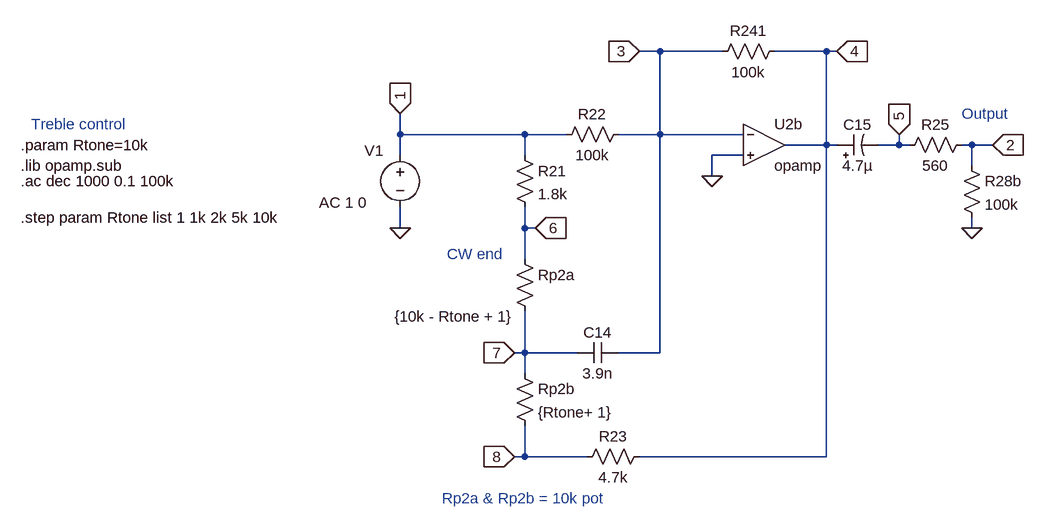
[diagram p0: schematic Klon-Centaur_treble_v1.asc]
Klon-Centaur_treble_v1.asc, the LTspice schematic file:
Version 4
SHEET 1 4496 5064
WIRE 2144 2432 2112 2432
WIRE 2240 2432 2144 2432
WIRE 2400 2432 2320 2432
WIRE 2416 2432 2400 2432
WIRE 1744 2560 1744 2528
WIRE 1936 2560 1744 2560
WIRE 2000 2560 1936 2560
WIRE 2144 2560 2144 2432
WIRE 2144 2560 2080 2560
WIRE 2272 2560 2144 2560
WIRE 2400 2576 2400 2432
WIRE 2400 2576 2336 2576
WIRE 2416 2576 2400 2576
WIRE 2512 2576 2512 2560
WIRE 2512 2576 2480 2576
WIRE 2528 2576 2512 2576
WIRE 2624 2576 2608 2576
WIRE 2656 2576 2624 2576
WIRE 1744 2592 1744 2560
WIRE 1936 2592 1936 2560
WIRE 2272 2592 2224 2592
WIRE 2624 2608 2624 2576
WIRE 2224 2624 2224 2592
WIRE 1744 2704 1744 2672
WIRE 1936 2704 1936 2672
WIRE 1952 2704 1936 2704
WIRE 2624 2704 2624 2688
WIRE 1936 2752 1936 2704
WIRE 1936 2896 1936 2832
WIRE 1936 2896 1920 2896
WIRE 2016 2896 1936 2896
WIRE 2144 2896 2144 2560
WIRE 2144 2896 2080 2896
WIRE 1936 2928 1936 2896
WIRE 1936 3056 1936 3008
WIRE 1936 3056 1920 3056
WIRE 2032 3056 1936 3056
WIRE 2400 3056 2400 2576
WIRE 2400 3056 2112 3056
FLAG 1744 2528 1
IOPIN 1744 2528 In
FLAG 2656 2576 2
IOPIN 2656 2576 In
FLAG 2224 2624 0
FLAG 1744 2704 0
FLAG 2624 2704 0
FLAG 1952 2704 6
IOPIN 1952 2704 In
FLAG 1920 2896 7
IOPIN 1920 2896 In
FLAG 1920 3056 8
IOPIN 1920 3056 In
FLAG 2112 2432 3
IOPIN 2112 2432 In
FLAG 2416 2432 4
IOPIN 2416 2432 In
FLAG 2512 2560 5
IOPIN 2512 2560 In
SYMBOL voltage 1744 2576 R0
WINDOW 0 -55 9 Left 2
WINDOW 123 -125 89 Left 2
WINDOW 39 0 0 Left 0
WINDOW 3 -289 58 Left 2
SYMATTR InstName V1
SYMATTR Value2 AC 1 0
SYMATTR Value ""
SYMBOL res 1920 2576 R0
SYMATTR InstName R21
SYMATTR Value 1.8k
SYMBOL res 2096 2544 R90
WINDOW 0 0 56 VBottom 2
WINDOW 3 32 56 VTop 2
SYMATTR InstName R22
SYMATTR Value 100k
SYMBOL res 1920 2736 R0
WINDOW 3 -2 104 Right 2
SYMATTR Value {10k - Rtone + 1}
SYMATTR InstName Rp2a
SYMBOL res 1920 2912 R0
SYMATTR InstName Rp2b
SYMATTR Value {Rtone+ 1}
SYMBOL cap 2080 2880 R90
WINDOW 0 0 32 VBottom 2
WINDOW 3 32 32 VTop 2
SYMATTR InstName C14
SYMATTR Value 3.9n
SYMBOL res 2336 2416 R90
WINDOW 0 0 56 VBottom 2
WINDOW 3 32 56 VTop 2
SYMATTR InstName R241
SYMATTR Value 100k
SYMBOL res 2624 2560 R90
WINDOW 0 0 56 VBottom 2
WINDOW 3 32 56 VTop 2
SYMATTR InstName R25
SYMATTR Value 560
SYMBOL res 2128 3040 R90
WINDOW 0 0 56 VBottom 2
WINDOW 3 32 56 VTop 2
SYMATTR InstName R23
SYMATTR Value 4.7k
SYMBOL OpAmps\\opamp 2304 2512 R0
SYMATTR InstName U2b
SYMBOL res 2608 2592 R0
SYMATTR InstName R28b
SYMATTR Value 100k
SYMBOL polcap 2416 2592 R270
WINDOW 0 32 32 VTop 2
WINDOW 3 0 32 VBottom 2
SYMATTR InstName C15
SYMATTR Value 4.7µ
TEXT 1160 2576 Left 2 !.param Rtone=10k
TEXT 1160 2608 Left 2 !.lib opamp.sub
TEXT 1160 2632 Left 2 !.ac dec 1000 0.1 100k
TEXT 1816 2744 Left 2 ;CW end
TEXT 1160 2688 Left 2 !.step param Rtone list 1 1k 2k 5k 10k
TEXT 2608 2528 Left 2 ;Output
TEXT 1808 3120 Left 2 ;Rp2a & Rp2b = 10k pot
TEXT 1176 2544 Left 2 ;Treble control

The netlist it stands for:
* Klon-Centaur_treble_v1.asc
V1 1 0 AC 1 0
R21 1 6 1.8k
R22 3 1 100k
Rp2a 6 7 {10k - Rtone + 1}
Rp2b 7 8 {Rtone+ 1}
C14 3 7 3.9n
R241 4 3 100k
R25 2 5 560
R23 4 8 4.7k
XU2b 3 0 4 opamp Aol=100K GBW=10Meg  ; pins invin noninvin out
R28b 2 0 100k
C15 4 5 4.7µ
.param Rtone=10k
.lib opamp.sub
.ac dec 1000 0.1 100k
* CW end
.step param Rtone list 1 1k 2k 5k 10k
* Output
* Rp2a & Rp2b = 10k pot
* Treble control
.backanno
.end